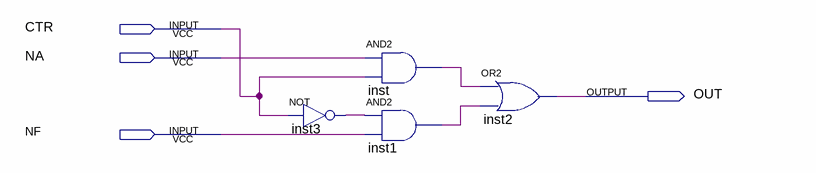
[diagram p0: schematic sheet]
// Quartus schematic multiplesador1_1.bdf as structural Verilog: 4 symbols, 4 pins
module multiplesador1_1 (
  input  CTR,
  input  NA,
  input  NF,
  output OUT
);

  wire inst1_out, inst3_out, inst_out;

  not inst3 (inst3_out, CTR);
  and inst (inst_out, NA, CTR);
  and inst1 (inst1_out, inst3_out, NF);
  or inst2 (OUT, inst_out, inst1_out);
endmodule
